# EAGLE design 2014_CanSat_main (EAGLE 6.5.0)
The CanSat main board schematic. The board is the same for both Payload and Container. On assembly of the boards for the container the light sensor may not be soldered.
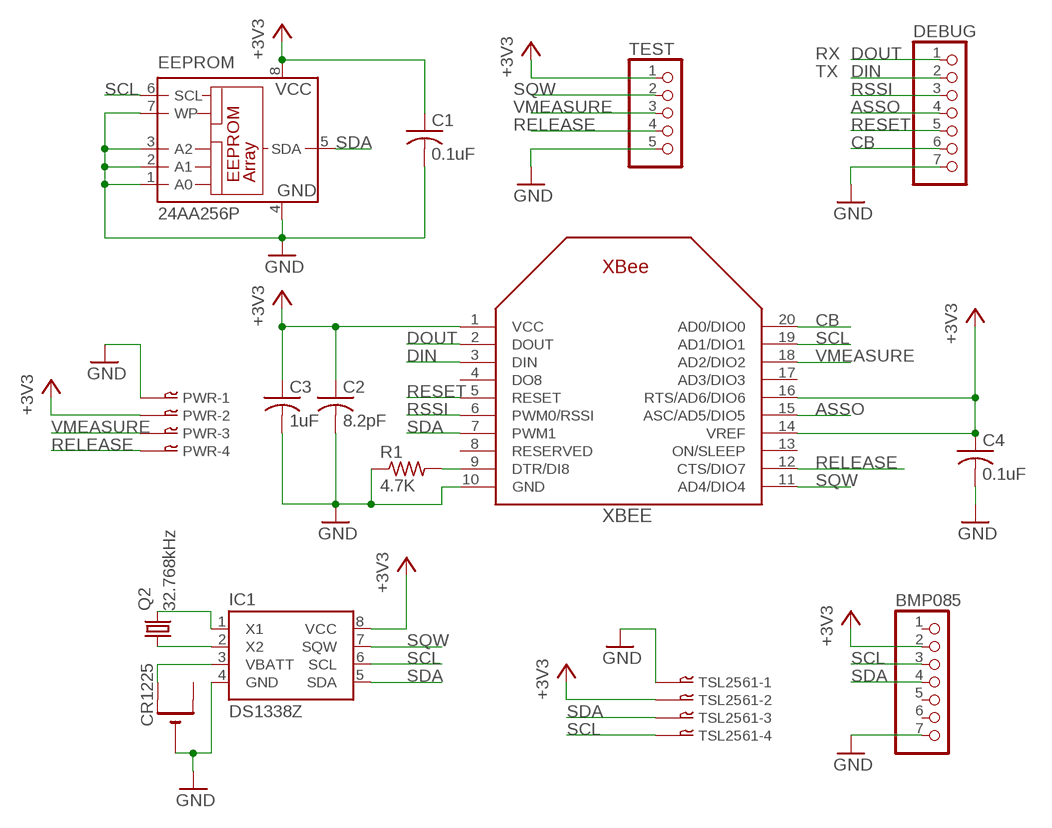
[diagram p0: schematic, sheet 1]

## Parts
BMP085  PINHD-1X7  [1X07]
C1  0.1uF  C-US050-024X044  [C050-024X044]
C2  8.2pF  C-US050-024X044  [C050-024X044]
C3  1uF  C-US050-024X044  [C050-024X044]
C4  0.1uF  C-US050-024X044  [C050-024X044]
CR1225  CR1220THM  [CR1220-THM]
DEBUG  PINHD-1X7  [1X07]
EEPROM  24AA256P  [DIL8]
IC1  DS1338Z  [SO08]
PWR  04-JST-B4B-XH-A  [B4B-XH]
Q2  32.768kHz  CRYSTALTC26H  [TC26H]
R1  4.7K  R-US_0309/10  [0309/10]
TEST  PINHD-1X5  [1X05]
TSL2561  04-JST-B4B-XH-A  [B4B-XH]
XBEE  XBEE  [XBEE]

## Nets
+3V3: BMP085.2 C1.1 C2.1 C3.1 C4.1 EEPROM.8(VCC) IC1.8(VCC) PWR.P$2 TEST.1 TSL2561.P$2 XBEE.1(VCC) XBEE.14(VREF) XBEE.16(RTS/AD6/DIO6)
ASSO: DEBUG.4 XBEE.15(ASC/AD5/DIO5)
CB: DEBUG.6 XBEE.20(AD0/DIO0)
DIN: DEBUG.2 XBEE.3(DIN)
DOUT: DEBUG.1 XBEE.2(DOUT)
GND: BMP085.7 C1.2 C2.2 C3.2 C4.2 CR1225.- DEBUG.7 EEPROM.1(A0) EEPROM.2(A1) EEPROM.3(A2) EEPROM.4(GND) EEPROM.7(WP) IC1.4(GND) PWR.P$1 R1.1 TEST.5 TSL2561.P$1 XBEE.10(GND)
N$1: R1.2 XBEE.9(DTR/DI8)
N$2: IC1.2(X2) Q2.1
N$3: IC1.1(X1) Q2.2
N$4: CR1225.+1(+) IC1.3(VBATT)
RELEASE: PWR.P$4 TEST.4 XBEE.12(CTS/DIO7)
RESET: DEBUG.5 XBEE.5(RESET)
RSSI: DEBUG.3 XBEE.6(PWM0/RSSI)
SCL: BMP085.3 EEPROM.6(SCL) IC1.6(SCL) TSL2561.P$4 XBEE.19(AD1/DIO1)
SDA: BMP085.4 EEPROM.5(SDA) IC1.5(SDA) TSL2561.P$3 XBEE.7(PWM1)
SQW: IC1.7(SQW) TEST.2 XBEE.11(AD4/DIO4)
VMEASURE: PWR.P$3 TEST.3 XBEE.18(AD2/DIO2)
Unconnected: BMP085.1 BMP085.5 BMP085.6 CR1225.+2(+1) XBEE.4(DO8) XBEE.8(RESERVED) XBEE.13(ON/SLEEP) XBEE.17(AD3/DIO3)

## Notes on the sheet
- RX
- TX

## Library data of the parts
BMP085 DEBUG = pinhead:PINHD-1X7: PIN HEADER
C1-C4 = adafruit:C-US: CAPACITOR, American symbol
CR1225 = adafruit:CR1220: CR1216/CR1220/CR1225 12mm 3V lithium coin cell Great for battery packup. Both SMT and THM holders. Note the THM package has the ground pads on both sides of the PCB so that the masks are the same - this reduces the cost
EEPROM = microchip:24*: Serial EEPROM I2C; MF: MICROCHIP; MPN: 24AA256-I/P; OC_FARNELL: 1331294; OC_NEWARK: 92C6872
IC1 = maxim-ic:DS1338
PWR TSL2561 = con-jst-xh:04-JST: JST CONNECTOR
Q2 = adafruit:CRYSTAL: CRYSTAL; OC_FARNELL: unknown; OC_NEWARK: unknown
R1 = resistor:R-US_: RESISTOR, American symbol
TEST = pinhead:PINHD-1X5: PIN HEADER
XBEE = adafruit:XBEE

## Net classes
0 default: width 0.305 mm, drill 0.508 mm, clearance 0.254 mm

## Board
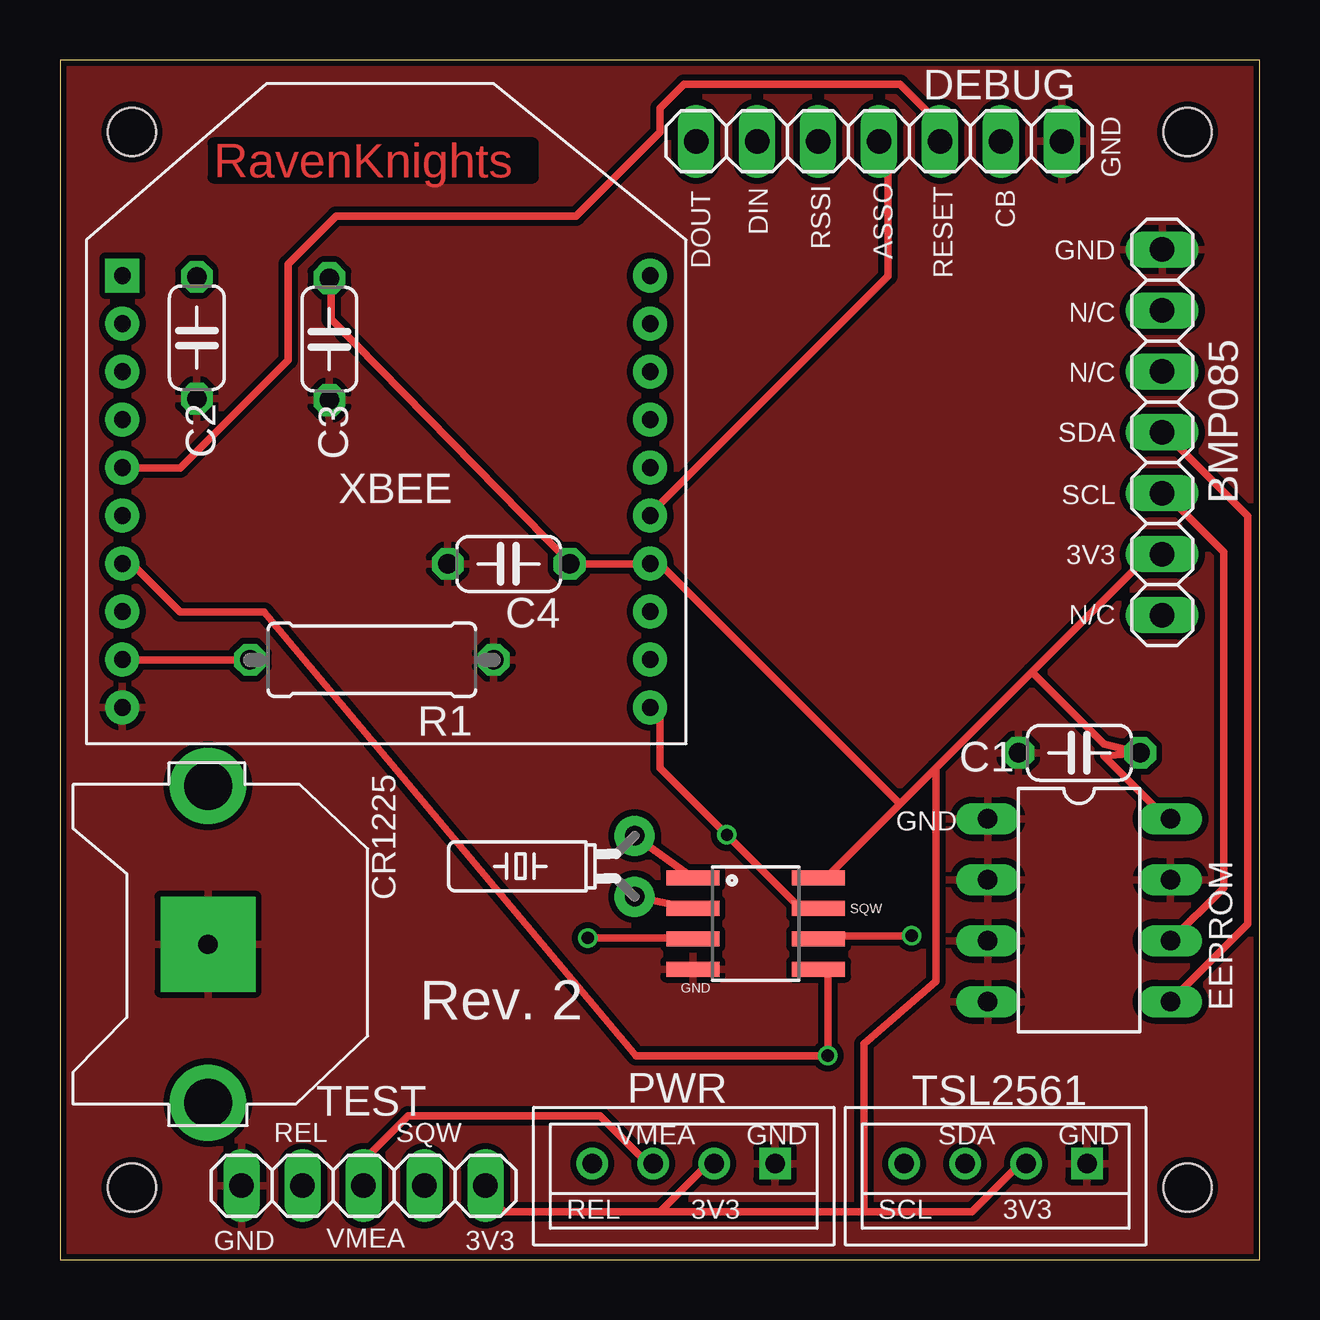
[diagram p1: board, top side]
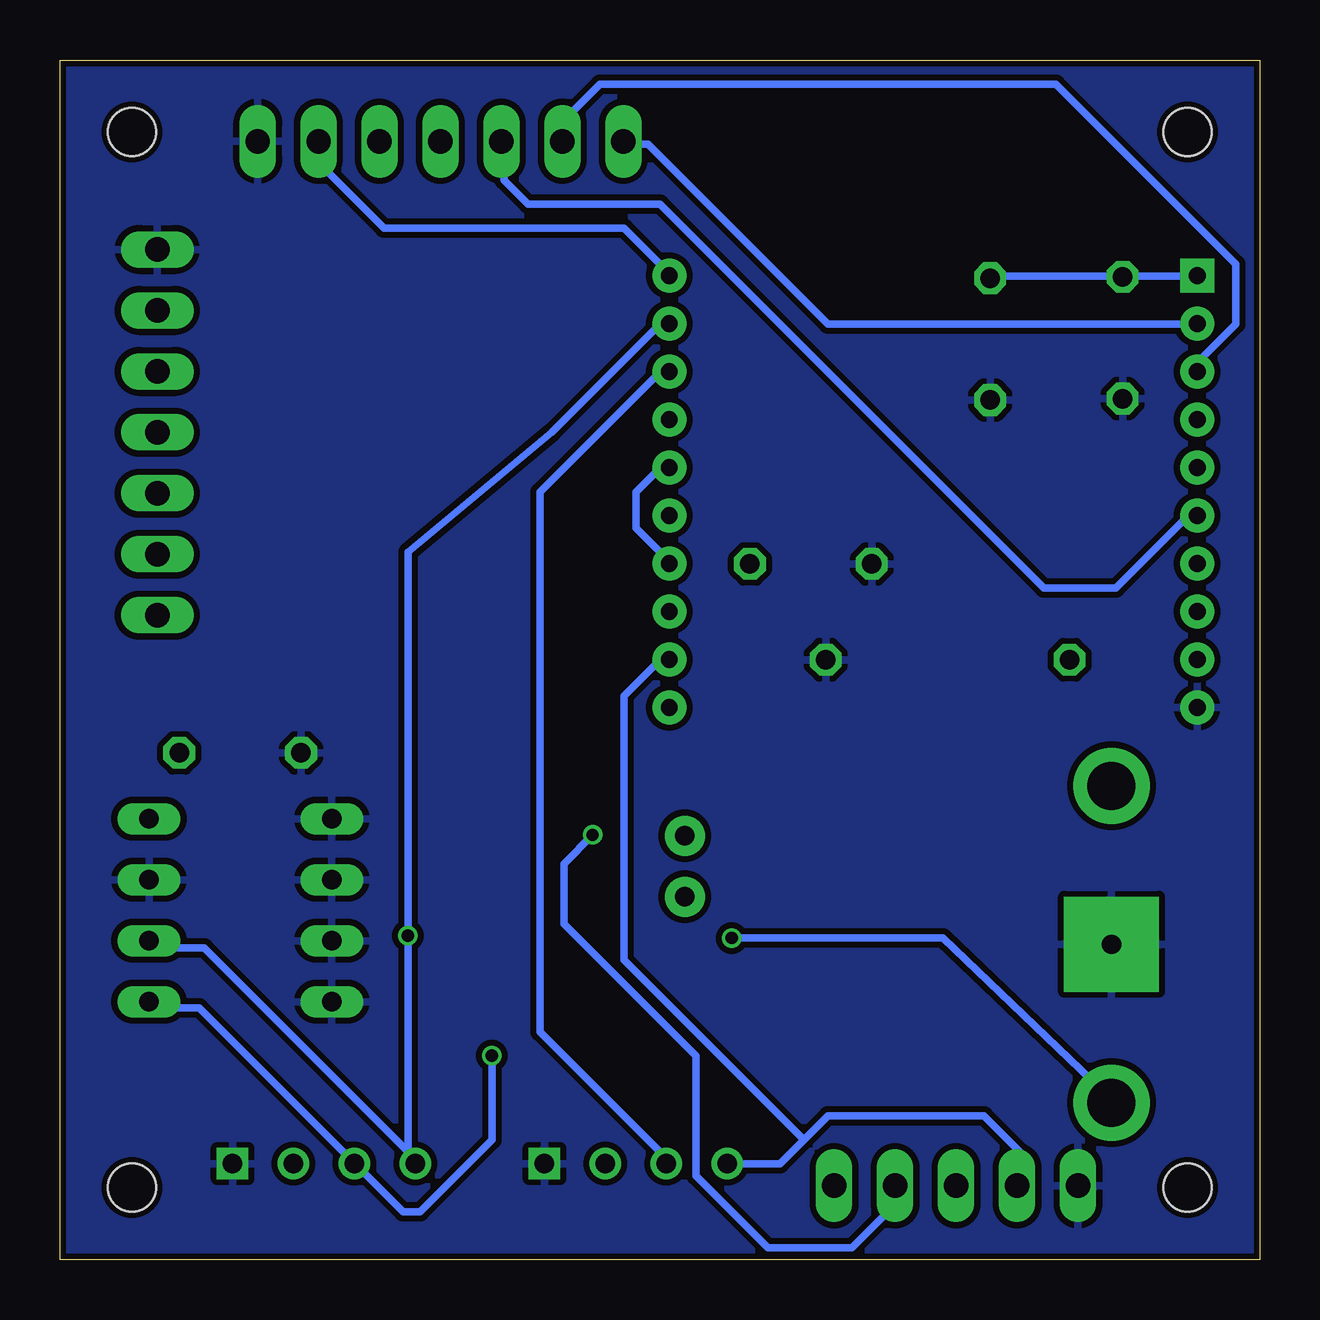
[diagram p2: board, bottom side, seen from below]

Size 50 x 50 mm. Coordinates in mm from the lower left corner, seen from the top.
Outline: 0,0 50,0 50,50 0,50 0,0
Copper layers (1*16): Top 0.035mm / dielectric 1.5mm / Bottom 0.035mm
Design rules "ITEADstudio_DRC": minimum track width 6mil, minimum drill 12mil, track to track 6mil, track to pad 6mil, pad to pad 6mil, via to via 6mil, smd to smd 0mil, copper to edge 10mil, drill to drill 10mil, minimum pad ring 10mil, minimum via ring 6mil, stop-mask expansion 2mil, vias tented up to drill 100mil, thermal gap 10mil
Holes 2 mm at 3,47 47,47 47,3 3,3
tKeepout: area 27.5,23.9 to 48.5,44.9

### Footprints (pad centres in the part's own frame; a part is rotated, then mirrored left to right if it is on the bottom)
1X07 = drill 1.016 long: 1 -7.62,0; 2 -5.08,0; 3 -2.54,0; 4 0,0; 5 2.54,0; 6 5.08,0; 7 7.62,0
C050-024X044 = drill 0.813 octagon: 1 -2.54,0; 2 2.54,0
CR1220-THM = drill 2 pad 3.175: +1 -6.604,0; +2 6.604,0 | drill 0.8 pad 3.962 square: - 0,0
DIL8 = drill 0.813 long: 1 -3.81,-3.81; 2 -1.27,-3.81; 3 1.27,-3.81; 4 3.81,-3.81; 5 3.81,3.81; 6 1.27,3.81; 7 -1.27,3.81; 8 -3.81,3.81
SO08 = smd 0.61 x 2.21: 1 -1.905,-2.616; 2 -0.635,-2.616; 3 0.635,-2.616; 4 1.905,-2.616; 5 1.905,2.616; 6 0.635,2.616; 7 -0.635,2.616; 8 -1.905,2.616
B4B-XH = drill 0.8 square: P$1 -3.81,0 | drill 0.8: P$2 -1.27,0; P$3 1.27,0; P$4 3.81,0
TC26H = drill 0.813 pad 1.676: 1 -1.27,0; 2 1.27,0
0309/10 = drill 0.813 octagon: 1 -5.08,0; 2 5.08,0
1X05 = drill 1.016 long: 1 -5.08,0; 2 -2.54,0; 3 0,0; 4 2.54,0; 5 5.08,0
XBEE = drill 0.7 pad 1.422 square: 1 -11,5.5 | drill 0.7 pad 1.422: 2 -11,3.5; 3 -11,1.5; 4 -11,-0.5; 5 -11,-2.5; 6 -11,-4.5; 7 -11,-6.5; 8 -11,-8.5; 9 -11,-10.5; 10 -11,-12.5; 11 11,-12.5; 12 11,-10.5; 13 11,-8.5; 14 11,-6.5; 15 11,-4.5; 16 11,-2.5; 17 11,-0.5; 18 11,1.5; 19 11,3.5; 20 11,5.5

### Placement (x,y rotation side)
BMP085  45.94,34.48 90 top
C1  42.49,21.12 180 top
C2  5.7,38.42 270 top
C3  11.23,38.37 270 top
C4  18.7,28.99 180 top
CR1225  6.17,13.14 90 top
DEBUG  34.14,46.61 0 top
EEPROM  42.48,14.56 270 top
IC1  29,14 270 top
PWR  26,4 180 top
Q2  23.95,16.39 90 top
R1  13,25 180 top
TEST  12.65,3.08 180 top
TSL2561  39,4 180 top
XBEE  13.6,35.51 0 top

### Tracks (layer width: path | path; a pad name or v marks a point on that pad's centre or on a via)
+3V3
  Top 0.305: 25,2 27,4 PWR.P$2 | 25,2 18.5,2 17.5,3 TEST.1 | 25,2 33.5,2 | 33.5,2 38,2 40,4 TSL2561.P$2 | EEPROM.8 46,18.5 43.5,21 C1.1 43.5,21.5 40.5,24.5 | 40.5,24.5 45.5,29.5 BMP085.2 | 40.5,24.5 36.5,20.5 | 36.5,20.5 35,19 | 35,19 32,16 IC1.8 | 35,19 25,29 XBEE.14 24.5,29 22.5,29 22,29 | 33.5,2 33.5,9 36.5,11.6 36.5,20.5 | 22,29 C4.1 | C3.1 11.3,40.4 11.3,39.2 21.3,29 22,29
  Bottom 0.305: XBEE.14 25,29.5 26,30.5 26,32 25,33 XBEE.16 | XBEE.1 3,41 5.5,41 C2.1 6,41 11,41 C3.1
ASSO
  Top 0.305: XBEE.15 25,31.5 34.5,41 34.5,46.5 DEBUG.4
CB
  Bottom 0.305: XBEE.20 25,41.5 26.5,43 36.5,43 39,45.5 39,46.5 DEBUG.6
DIN
  Bottom 0.305: XBEE.3 2.5,37.5 1,39 1,41.5 8.5,49 27.5,49 29.5,47 DEBUG.2
DOUT
  Bottom 0.305: XBEE.2 3,39 18,39 25.5,46.5 26.5,46.5 DEBUG.1
GND
  pour Top: -2,52 -2,-2 52,-2 52,52
  pour Bottom: -1,51 -1,-1 51,-1 51,51
N$1
  Top 0.305: R1.2 3,25 XBEE.9
N$2
  Top 0.305: Q2.1 IC1.2
N$3
  Top 0.305: Q2.2 IC1.1
N$4  (via drill 0.51)
  Top 0.305: v22,13.4 26,13.4 IC1.3
  Bottom 0.305: v22,13.4 13.2,13.4 6.5,7 CR1225.+1
RELEASE
  Bottom 0.305: PWR.P$4 20,4 19,5 | 19,5 18,6 11.5,6 10,4.5 10,3.5 TEST.4 | 19,5 26.5,12.5 26.5,23.5 25,25 XBEE.12
RESET
  Top 0.305: XBEE.5 3,33 5,33 9.5,37.5 9.5,41.5 11.5,43.5 21.5,43.5 25,47 25,48 26,49 35,49 37,47 DEBUG.5
RSSI
  Bottom 0.305: XBEE.6 3,31 6,28 9,28 25,44 30.5,44 31.5,45 31.5,46.5 DEBUG.3
SCL  (via drill 0.51)
  Top 0.305: v35.5,13.5 32,13.5 IC1.6 | EEPROM.6 48.5,15.5 48.5,29.5 46.5,31.5 46,31.5 BMP085.3
  Bottom 0.305: 35.5,4.5 v35.5,13.5 35.5,29.5 29.5,34.5 25,39 XBEE.19 | 35.5,4.5 35,4 TSL2561.P$4 | 35.5,4.5 44,13 46,13 EEPROM.6
SDA  (via drill 0.51)
  Top 0.305: IC1.5 32,12 v32,8.5 24,8.5 8.5,27 5,27 3,29 XBEE.7 | BMP085.4 46,34 46.5,34 49.5,31 49.5,14 46.5,11 EEPROM.5
  Bottom 0.305: v32,8.5 32,5 35,2 35.7,2 37.7,4 | 37.7,4 44.2,10.5 46,10.5 EEPROM.5 | 37.7,4 TSL2561.P$3
SQW  (via drill 0.51)
  Top 0.305: IC1.7 31.5,14.5 31,14.5 v27.8,17.7 25,20.5 25,23 XBEE.11
  Bottom 0.305: v27.8,17.7 29,16.5 29,14 23.5,8.5 23.5,3.5 20.5,0.5 17,0.5 15.5,2 15.5,3 TEST.2
VMEASURE
  Top 0.305: PWR.P$3 24.5,4 22.5,6 14.5,6 13,4.5 13,3.5 TEST.3
  Bottom 0.305: XBEE.18 25,37 30,32 30,9.5 24.5,4 PWR.P$3

### Text on the board
Top: RavenKnights
tSilk: GND | DIN | CB | RSSI | ASSO | GND | DOUT | RESET | N/C | N/C | SDA | SCL | 3V3 | N/C | GND | CR1225 | SQW | GND | Rev. 2 | REL | SQW | VMEA | GND | SDA | GND | REL | 3V3 | SCL | 3V3 | GND | VMEA | 3V3